# Altium project HLib-Comm-BLE.PrjPcb
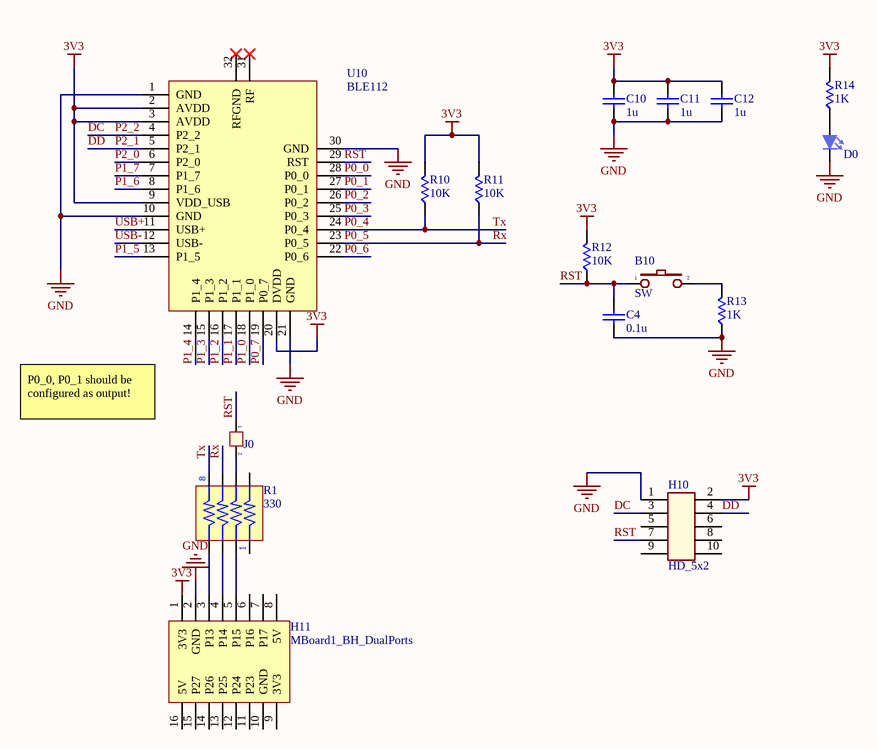
[diagram p0: HLib-Comm-BLE.SchDoc]
1 sheet, 16 parts. Net scope: hierarchical (ports join the sheet entries above them; power ports are global).
Board file: PCB1.PcbDoc

## Sheet HLib-Comm-BLE.SchDoc
size A

### Parts
B10  SW  [SW2SMD]
C4  value 0.1u  [SM_0805_C_CERAMIC]  (hidden comment: C_Ceramic)
C10  value 1u  [SM_0805_C_CERAMIC]  (hidden comment: C_Ceramic)
C11  value 1u  [SM_0805_C_CERAMIC]  (hidden comment: C_Ceramic)
C12  value 1u  [SM_0805_C_CERAMIC]  (hidden comment: C_Ceramic)
D0  LED  [SM_0805_LED]  (value not drawn)
H10  HD_5x2  [HD_male_5x2_100mil_straight]
H11  MBoard1_BH_DualPorts  [MBoard1_BH_DualPorts]
J0  Jumper 2  [J2]  (value not drawn)
R1  330  [RA4]
R10  value 10K  [SM_0805_R]  (hidden comment: R)
R11  value 10K  [SM_0805_R]  (hidden comment: R)
R12  value 10K  [SM_0805_R]  (hidden comment: R)
R13  value 1K  [SM_0805_R]  (hidden comment: R)
R14  value 1K  [SM_0805_R]  (hidden comment: R)
U10  BLE112  [BLE112]

### Nets
3V3: C10.2 C11.2 C12.2 H10.2 H11.1(3V3) R10.2 R11.2 R12.2 R14.2 U10.2(AVDD) U10.3(AVDD) U10.9(VDD_USB) U10.20(DVDD)
GND: C4.1 C10.1 C11.1 C12.1 D0.2(K) H10.1 H11.2(GND) R13.1 U10.1(GND) U10.10(GND) U10.21(GND) U10.30(GND)
DC: H10.3 U10.4(P2_2)  [also labelled P2_2]
DD: H10.4 U10.5(P2_1)  [also labelled P2_1]
P0_0: U10.28(P0_0)
P0_1: U10.27(P0_1)
P0_2: U10.26(P0_2)
P0_3: U10.25(P0_3)
P0_4: R1.8 R10.1 U10.24(P0_4)  [also labelled Tx]
P0_5: R1.6 R11.1 U10.23(P0_5)  [also labelled Rx]
P0_6: U10.22(P0_6)
P0_7: U10.19(P0_7)
P1_0: U10.18(P1_0)
P1_1: U10.17(P1_1)
P1_2: U10.16(P1_2)
P1_3: U10.15(P1_3)
P1_4: U10.14(P1_4)
P1_5: U10.13(P1_5)
P1_6: U10.8(P1_6)
P1_7: U10.7(P1_7)
P2_0: U10.6(P2_0)
RST: B10.1 C4.2 H10.7 J0.1 R12.1 U10.29(RST)
USB+: U10.11(USB+)
USB-: U10.12(USB-)
NetB10_2: B10.2 R13.2
NetD0_1: D0.1(A) R14.1
NetH11_3: H11.3(P13) R1.7
NetH11_4: H11.4(P14) R1.5
NetH11_5: H11.5(P15) R1.3
NetJ0_2: J0.2 R1.4

Not connected (* = marked no-connect by the designer): H10 5 6 8 9 10; H11 6(P16) 7(P17) 8(5V) 9(3V3) 10(GND) 11(P23) 12(P24) 13(P25) 14(P26) 15(P27) 16(5V); R1 1 2; U10 31(RF)* 32(RFGND)*

### Notes on the sheet
- P0_0, P0_1 should be configured as output!

### Library data of the parts
B10 = SW2: Switch button 2 pin; Value: SW chip 2 pin
C4 C10-C12 = C_Ceramic: Non-polarity ceramic capacitor; Published: 8-Jun-2000; LatestRevisionDate: 17-Jul-2002; LatestRevisionNote: Re-released for DXP Platform.; PackageReference: RAD-0.3; Publisher: Altium Limited; PackageDescription: Radial Cap, Thru-Hole; 2 Leads; 0.3 in Pin Spacing
H10 = HD_5x2: Header, 5-pins/row, double row,
J0 = JP 2: Value: JP 2
R1 = RA4
R10-R14 = R: Resistor; Published: 8-Jun-2000; LatestRevisionDate: 29-May-2009; LatestRevisionNote: IPC-7351 Footprint Added.; PackageReference: J1-0603; Publisher: Altium Limited; PackageDescription: Chip Resistor
D0 = LED: Published: 8-Jun-2000; LatestRevisionDate: 08-Jul-2005; LatestRevisionNote: Mech Layer 1 removed.; PackageReference: LED-1; Publisher: Altium Limited; PackageDescription: LED; 2 Leads